# Altium schematic sheet DDR.SchDoc
size A3
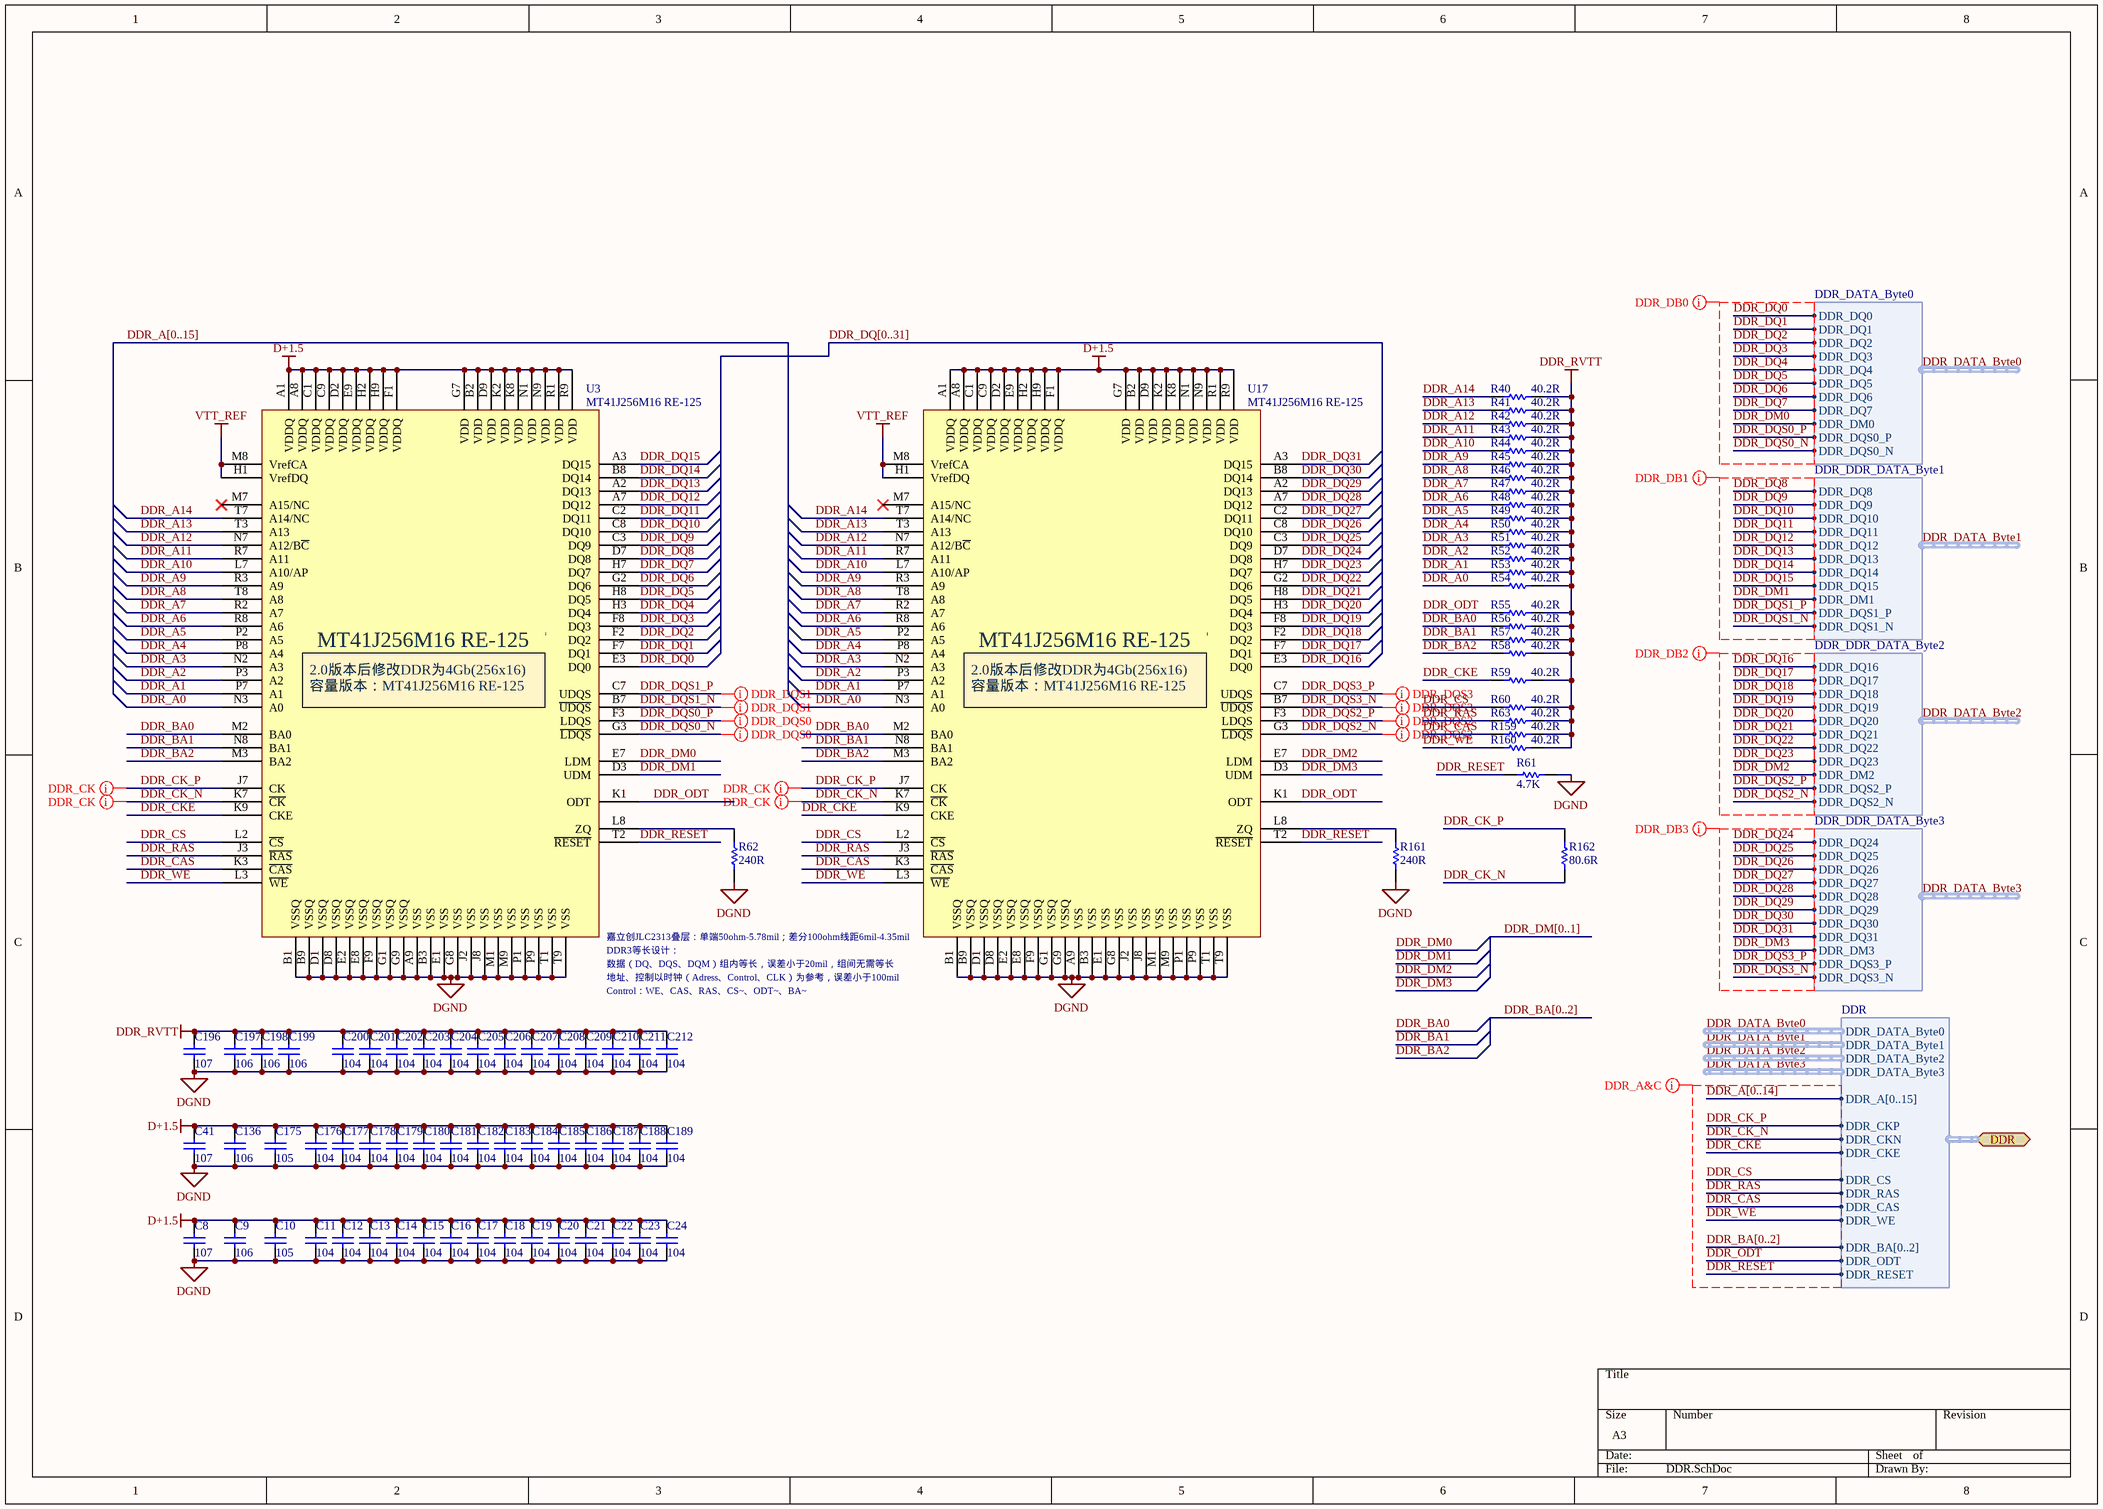
[diagram p0: DDR.SchDoc]

## Parts
C8  107  [C 1206_L]
C9  106  [C 0603_L]
C10  105  [C 0603_L]
C11  104  [C 0402_LL]
C12  104  [C 0402_LL]
C13  104  [C 0402_LL]
C14  104  [C 0402_LL]
C15  104  [C 0402_LL]
C16  104  [C 0402_LL]
C17  104  [C 0402_LL]
C18  104  [C 0402_LL]
C19  104  [C 0402_LL]
C20  104  [C 0402_LL]
C21  104  [C 0402_LL]
C22  104  [C 0402_LL]
C23  104  [C 0402_LL]
C24  104  [C 0402_LL]
C41  107  [C 1206_L]
C136  106  [C 0603_L]
C175  105  [C 0603_L]
C176  104  [C 0402_LL]
C177  104  [C 0402_LL]
C178  104  [C 0402_LL]
C179  104  [C 0402_LL]
C180  104  [C 0402_LL]
C181  104  [C 0402_LL]
C182  104  [C 0402_LL]
C183  104  [C 0402_LL]
C184  104  [C 0402_LL]
C185  104  [C 0402_LL]
C186  104  [C 0402_LL]
C187  104  [C 0402_LL]
C188  104  [C 0402_LL]
C189  104  [C 0402_LL]
C196  107  [C 1206_L]
C197  106  [C 0603_L]
C198  106  [C 0603_L]
C199  106  [C 0603_L]
C200  104  [C 0402_LL]
C201  104  [C 0402_LL]
C202  104  [C 0402_LL]
C203  104  [C 0402_LL]
C204  104  [C 0402_LL]
C205  104  [C 0402_LL]
C206  104  [C 0402_LL]
C207  104  [C 0402_LL]
C208  104  [C 0402_LL]
C209  104  [C 0402_LL]
C210  104  [C 0402_LL]
C211  104  [C 0402_LL]
C212  104  [C 0402_LL]
R40  40.2R  [R 0402_L]
R41  40.2R  [R 0402_L]
R42  40.2R  [R 0402_L]
R43  40.2R  [R 0402_L]
R44  40.2R  [R 0402_L]
R45  40.2R  [R 0402_L]
R46  40.2R  [R 0402_L]
R47  40.2R  [R 0402_L]
R48  40.2R  [R 0402_L]
R49  40.2R  [R 0402_L]
R50  40.2R  [R 0402_L]
R51  40.2R  [R 0402_L]
R52  40.2R  [R 0402_L]
R53  40.2R  [R 0402_L]
R54  40.2R  [R 0402_L]
R55  40.2R  [R 0402_L]
R56  40.2R  [R 0402_L]
R57  40.2R  [R 0402_L]
R58  40.2R  [R 0402_L]
R59  40.2R  [R 0402_L]
R60  40.2R  [R 0402_L]
R61  4.7K  [R 0402_L]
R62  240R  [R 0603_L]
R63  40.2R  [R 0402_L]
R159  40.2R  [R 0402_L]
R160  40.2R  [R 0402_L]
R161  240R  [R 0603_L]
R162  80.6R  [R 0402_L]
U3  MT41J256M16 RE-125  [FBGA96]
U17  MT41J256M16 RE-125  [FBGA96]

## Ports
DDR (bidir, harness DDR)

## Harnesses
DDR: DDR_A[0..15], DDR_CKP, DDR_CKN, DDR_CKE, DDR_CS, DDR_RAS, DDR_CAS, DDR_WE, DDR_DATA_Byte0, DDR_DATA_Byte1, DDR_DATA_Byte2, DDR_DATA_Byte3, DDR_BA[0..2], DDR_ODT, DDR_RESET
DDR_DDR_DATA_Byte3: DDR_DQ24, DDR_DQ25, DDR_DQ26, DDR_DQ27, DDR_DQ28, DDR_DQ29, DDR_DQ30, DDR_DQ31, DDR_DM3, DDR_DQS3_P, DDR_DQS3_N
DDR_DDR_DATA_Byte2: DDR_DQ16, DDR_DQ17, DDR_DQ18, DDR_DQ19, DDR_DQ20, DDR_DQ21, DDR_DQ22, DDR_DQ23, DDR_DM2, DDR_DQS2_P, DDR_DQS2_N
DDR_DDR_DATA_Byte1: DDR_DQ8, DDR_DQ9, DDR_DQ10, DDR_DQ11, DDR_DQ12, DDR_DQ13, DDR_DQ14, DDR_DQ15, DDR_DM1, DDR_DQS1_P, DDR_DQS1_N
DDR_DATA_Byte0: DDR_DQ0, DDR_DQ1, DDR_DQ2, DDR_DQ3, DDR_DQ4, DDR_DQ5, DDR_DQ6, DDR_DQ7, DDR_DM0, DDR_DQS0_P, DDR_DQS0_N

## Nets
D+1.5: C8.2 C9.2 C10.2 C11.2 C12.2 C13.2 C14.2 C15.2 C16.2 C17.2 C18.2 C19.2 C20.2 C21.2 C22.2 C23.2 C24.2 C41.2 C136.2 C175.2 C176.2 C177.2 C178.2 C179.2 C180.2 C181.2 C182.2 C183.2 C184.2 C185.2 C186.2 C187.2 C188.2 C189.2 U3.A1(VDDQ) U3.A8(VDDQ) U3.B2(VDD) U3.C1(VDDQ) U3.C9(VDDQ) U3.D2(VDDQ) U3.D9(VDD) U3.E9(VDDQ) U3.F1(VDDQ) U3.G7(VDD) U3.H2(VDDQ) U3.H9(VDDQ) U3.K2(VDD) U3.K8(VDD) U3.N1(VDD) U3.N9(VDD) U3.R1(VDD) U3.R9(VDD) U17.A1(VDDQ) U17.A8(VDDQ) U17.B2(VDD) U17.C1(VDDQ) U17.C9(VDDQ) U17.D2(VDDQ) U17.D9(VDD) U17.E9(VDDQ) U17.F1(VDDQ) U17.G7(VDD) U17.H2(VDDQ) U17.H9(VDDQ) U17.K2(VDD) U17.K8(VDD) U17.N1(VDD) U17.N9(VDD) U17.R1(VDD) U17.R9(VDD)
DDR_RVTT: C196.2 C197.2 C198.2 C199.2 C200.2 C201.2 C202.2 C203.2 C204.2 C205.2 C206.2 C207.2 C208.2 C209.2 C210.2 C211.2 C212.2 R40.2 R41.2 R42.2 R43.2 R44.2 R45.2 R46.2 R47.2 R48.2 R49.2 R50.2 R51.2 R52.2 R53.2 R54.2 R55.1 R56.2 R57.2 R58.2 R59.2 R60.2 R63.2 R159.2 R160.2
DGND: C8.1 C9.1 C10.1 C11.1 C12.1 C13.1 C14.1 C15.1 C16.1 C17.1 C18.1 C19.1 C20.1 C21.1 C22.1 C23.1 C24.1 C41.1 C136.1 C175.1 C176.1 C177.1 C178.1 C179.1 C180.1 C181.1 C182.1 C183.1 C184.1 C185.1 C186.1 C187.1 C188.1 C189.1 C196.1 C197.1 C198.1 C199.1 C200.1 C201.1 C202.1 C203.1 C204.1 C205.1 C206.1 C207.1 C208.1 C209.1 C210.1 C211.1 C212.1 R61.1 R62.1 R161.1 U3.A9(VSS) U3.B1(VSSQ) U3.B3(VSS) U3.B9(VSSQ) U3.D1(VSSQ) U3.D8(VSSQ) U3.E1(VSS) U3.E2(VSSQ) U3.E8(VSSQ) U3.F9(VSSQ) U3.G1(VSSQ) U3.G8(VSS) U3.G9(VSSQ) U3.J2(VSS) U3.J8(VSS) U3.M1(VSS) U3.M9(VSS) U3.P1(VSS) U3.P9(VSS) U3.T1(VSS) U3.T9(VSS) U17.A9(VSS) U17.B1(VSSQ) U17.B3(VSS) U17.B9(VSSQ) U17.D1(VSSQ) U17.D8(VSSQ) U17.E1(VSS) U17.E2(VSSQ) U17.E8(VSSQ) U17.F9(VSSQ) U17.G1(VSSQ) U17.G8(VSS) U17.G9(VSSQ) U17.J2(VSS) U17.J8(VSS) U17.M1(VSS) U17.M9(VSS) U17.P1(VSS) U17.P9(VSS) U17.T1(VSS) U17.T9(VSS)
VTT_REF: U3.H1(VrefDQ) U3.M8(VrefCA) U17.H1(VrefDQ) U17.M8(VrefCA)
DDR_A0: R54.1 U3.N3(A0) U17.N3(A0)
DDR_A1: R53.1 U3.P7(A1) U17.P7(A1)
DDR_A2: R52.1 U3.P3(A2) U17.P3(A2)
DDR_A3: R51.1 U3.N2(A3) U17.N2(A3)
DDR_A4: R50.1 U3.P8(A4) U17.P8(A4)
DDR_A5: R49.1 U3.P2(A5) U17.P2(A5)
DDR_A6: R48.1 U3.R8(A6) U17.R8(A6)
DDR_A7: R47.1 U3.R2(A7) U17.R2(A7)
DDR_A8: R46.1 U3.T8(A8) U17.T8(A8)
DDR_A9: R45.1 U3.R3(A9) U17.R3(A9)
DDR_A10: R44.1 U3.L7(A10/AP) U17.L7(A10/AP)
DDR_A11: R43.1 U3.R7(A11) U17.R7(A11)
DDR_A12: R42.1 U3.N7(A12/B~{C}) U17.N7(A12/B~{C})
DDR_A13: R41.1 U3.T3(A13) U17.T3(A13)
DDR_A14: R40.1 U3.T7(A14/NC) U17.T7(A14/NC)
DDR_BA0: R56.1 U3.M2(BA0) U17.M2(BA0)
DDR_BA1: R57.1 U3.N8(BA1) U17.N8(BA1)
DDR_BA2: R58.1 U3.M3(BA2) U17.M3(BA2)
DDR_CAS: R159.1 U3.K3(~{CAS}) U17.K3(~{CAS}) ; port DDR.DDR_CAS
DDR_CK_N: R162.2 U3.K7(~{CK}) U17.K7(~{CK}) ; port DDR.DDR_CKN
DDR_CK_P: R162.1 U3.J7(CK) U17.J7(CK) ; port DDR.DDR_CKP
DDR_CKE: R59.1 U3.K9(CKE) U17.K9(CKE) ; port DDR.DDR_CKE
DDR_CS: R60.1 U3.L2(~{CS}) U17.L2(~{CS}) ; port DDR.DDR_CS
DDR_DM0: U3.E7(LDM) ; harness DDR_DATA_Byte0.DDR_DM0  [project net DDR_DATA_Byte0.DDR_DM0]
DDR_DM1: U3.D3(UDM) ; harness DDR_DDR_DATA_Byte1.DDR_DM1  [project net DDR_DATA_Byte1.DDR_DM1]
DDR_DM2: U17.E7(LDM) ; harness DDR_DDR_DATA_Byte2.DDR_DM2  [project net DDR_DATA_Byte2.DDR_DM2]
DDR_DM3: U17.D3(UDM) ; harness DDR_DDR_DATA_Byte3.DDR_DM3  [project net DDR_DATA_Byte3.DDR_DM3]
DDR_DQ0: U3.E3(DQ0) ; harness DDR_DATA_Byte0.DDR_DQ0  [project net DDR_DATA_Byte0.DDR_DQ0]
DDR_DQ1: U3.F7(DQ1) ; harness DDR_DATA_Byte0.DDR_DQ1  [project net DDR_DATA_Byte0.DDR_DQ1]
DDR_DQ2: U3.F2(DQ2) ; harness DDR_DATA_Byte0.DDR_DQ2  [project net DDR_DATA_Byte0.DDR_DQ2]
DDR_DQ3: U3.F8(DQ3) ; harness DDR_DATA_Byte0.DDR_DQ3  [project net DDR_DATA_Byte0.DDR_DQ3]
DDR_DQ4: U3.H3(DQ4) ; harness DDR_DATA_Byte0.DDR_DQ4  [project net DDR_DATA_Byte0.DDR_DQ4]
DDR_DQ5: U3.H8(DQ5) ; harness DDR_DATA_Byte0.DDR_DQ5  [project net DDR_DATA_Byte0.DDR_DQ5]
DDR_DQ6: U3.G2(DQ6) ; harness DDR_DATA_Byte0.DDR_DQ6  [project net DDR_DATA_Byte0.DDR_DQ6]
DDR_DQ7: U3.H7(DQ7) ; harness DDR_DATA_Byte0.DDR_DQ7  [project net DDR_DATA_Byte0.DDR_DQ7]
DDR_DQ8: U3.D7(DQ8) ; harness DDR_DDR_DATA_Byte1.DDR_DQ8  [project net DDR_DATA_Byte1.DDR_DQ8]
DDR_DQ9: U3.C3(DQ9) ; harness DDR_DDR_DATA_Byte1.DDR_DQ9  [project net DDR_DATA_Byte1.DDR_DQ9]
DDR_DQ10: U3.C8(DQ10) ; harness DDR_DDR_DATA_Byte1.DDR_DQ10  [project net DDR_DATA_Byte1.DDR_DQ10]
DDR_DQ11: U3.C2(DQ11) ; harness DDR_DDR_DATA_Byte1.DDR_DQ11  [project net DDR_DATA_Byte1.DDR_DQ11]
DDR_DQ12: U3.A7(DQ12) ; harness DDR_DDR_DATA_Byte1.DDR_DQ12  [project net DDR_DATA_Byte1.DDR_DQ12]
DDR_DQ13: U3.A2(DQ13) ; harness DDR_DDR_DATA_Byte1.DDR_DQ13  [project net DDR_DATA_Byte1.DDR_DQ13]
DDR_DQ14: U3.B8(DQ14) ; harness DDR_DDR_DATA_Byte1.DDR_DQ14  [project net DDR_DATA_Byte1.DDR_DQ14]
DDR_DQ15: U3.A3(DQ15) ; harness DDR_DDR_DATA_Byte1.DDR_DQ15  [project net DDR_DATA_Byte1.DDR_DQ15]
DDR_DQ16: U17.E3(DQ0) ; harness DDR_DDR_DATA_Byte2.DDR_DQ16  [project net DDR_DATA_Byte2.DDR_DQ16]
DDR_DQ17: U17.F7(DQ1) ; harness DDR_DDR_DATA_Byte2.DDR_DQ17  [project net DDR_DATA_Byte2.DDR_DQ17]
DDR_DQ18: U17.F2(DQ2) ; harness DDR_DDR_DATA_Byte2.DDR_DQ18  [project net DDR_DATA_Byte2.DDR_DQ18]
DDR_DQ19: U17.F8(DQ3) ; harness DDR_DDR_DATA_Byte2.DDR_DQ19  [project net DDR_DATA_Byte2.DDR_DQ19]
DDR_DQ20: U17.H3(DQ4) ; harness DDR_DDR_DATA_Byte2.DDR_DQ20  [project net DDR_DATA_Byte2.DDR_DQ20]
DDR_DQ21: U17.H8(DQ5) ; harness DDR_DDR_DATA_Byte2.DDR_DQ21  [project net DDR_DATA_Byte2.DDR_DQ21]
DDR_DQ22: U17.G2(DQ6) ; harness DDR_DDR_DATA_Byte2.DDR_DQ22  [project net DDR_DATA_Byte2.DDR_DQ22]
DDR_DQ23: U17.H7(DQ7) ; harness DDR_DDR_DATA_Byte2.DDR_DQ23  [project net DDR_DATA_Byte2.DDR_DQ23]
DDR_DQ24: U17.D7(DQ8) ; harness DDR_DDR_DATA_Byte3.DDR_DQ24  [project net DDR_DATA_Byte3.DDR_DQ24]
DDR_DQ25: U17.C3(DQ9) ; harness DDR_DDR_DATA_Byte3.DDR_DQ25  [project net DDR_DATA_Byte3.DDR_DQ25]
DDR_DQ26: U17.C8(DQ10) ; harness DDR_DDR_DATA_Byte3.DDR_DQ26  [project net DDR_DATA_Byte3.DDR_DQ26]
DDR_DQ27: U17.C2(DQ11) ; harness DDR_DDR_DATA_Byte3.DDR_DQ27  [project net DDR_DATA_Byte3.DDR_DQ27]
DDR_DQ28: U17.A7(DQ12) ; harness DDR_DDR_DATA_Byte3.DDR_DQ28  [project net DDR_DATA_Byte3.DDR_DQ28]
DDR_DQ29: U17.A2(DQ13) ; harness DDR_DDR_DATA_Byte3.DDR_DQ29  [project net DDR_DATA_Byte3.DDR_DQ29]
DDR_DQ30: U17.B8(DQ14) ; harness DDR_DDR_DATA_Byte3.DDR_DQ30  [project net DDR_DATA_Byte3.DDR_DQ30]
DDR_DQ31: U17.A3(DQ15) ; harness DDR_DDR_DATA_Byte3.DDR_DQ31  [project net DDR_DATA_Byte3.DDR_DQ31]
DDR_DQS0_N: U3.G3(~{LDQS}) ; harness DDR_DATA_Byte0.DDR_DQS0_N  [project net DDR_DATA_Byte0.DDR_DQS0_N]
DDR_DQS0_P: U3.F3(LDQS) ; harness DDR_DATA_Byte0.DDR_DQS0_P  [project net DDR_DATA_Byte0.DDR_DQS0_P]
DDR_DQS1_N: U3.B7(~{UDQS}) ; harness DDR_DDR_DATA_Byte1.DDR_DQS1_N  [project net DDR_DATA_Byte1.DDR_DQS1_N]
DDR_DQS1_P: U3.C7(UDQS) ; harness DDR_DDR_DATA_Byte1.DDR_DQS1_P  [project net DDR_DATA_Byte1.DDR_DQS1_P]
DDR_DQS2_N: U17.G3(~{LDQS}) ; harness DDR_DDR_DATA_Byte2.DDR_DQS2_N  [project net DDR_DATA_Byte2.DDR_DQS2_N]
DDR_DQS2_P: U17.F3(LDQS) ; harness DDR_DDR_DATA_Byte2.DDR_DQS2_P  [project net DDR_DATA_Byte2.DDR_DQS2_P]
DDR_DQS3_N: U17.B7(~{UDQS}) ; harness DDR_DDR_DATA_Byte3.DDR_DQS3_N  [project net DDR_DATA_Byte3.DDR_DQS3_N]
DDR_DQS3_P: U17.C7(UDQS) ; harness DDR_DDR_DATA_Byte3.DDR_DQS3_P  [project net DDR_DATA_Byte3.DDR_DQS3_P]
DDR_ODT: R55.2 U3.K1(ODT) U17.K1(ODT) ; port DDR.DDR_ODT
DDR_RAS: R63.1 U3.J3(~{RAS}) U17.J3(~{RAS}) ; port DDR.DDR_RAS
DDR_RESET: R61.2 U3.T2(~{RESET}) U17.T2(~{RESET}) ; port DDR.DDR_RESET
DDR_WE: R160.1 U3.L3(~{WE}) U17.L3(~{WE}) ; port DDR.DDR_WE
NetR62_2: R62.2 U3.L8(ZQ)
NetR161_2: R161.2 U17.L8(ZQ)

Not connected (* = marked no-connect by the designer): U3 J1 J9 L1 L9 M7(A15/NC)*; U17 J1 J9 L1 L9 M7(A15/NC)*

## Buses and harness runs
bus DDR_A[0..14]
bus DDR_A[0..15]
bus DDR_BA[0..2]
bus DDR_DM[0..1]
bus DDR_DQ[0..31]

## Layout directives
differential pair; differential pair class DDR_DQS1: DDR_DATA_Byte1.DDR_DQS1_N, DDR_DATA_Byte1.DDR_DQS1_P
differential pair; differential pair class DDR_DQS3: DDR_DATA_Byte3.DDR_DQS3_N, DDR_DATA_Byte3.DDR_DQS3_P
differential pair; differential pair class DDR_DQS0: DDR_CK_N, DDR_CK_P, DDR_DATA_Byte0.DDR_DQS0_N, DDR_DATA_Byte0.DDR_DQS0_P
differential pair; differential pair class DDR_DQS2: DDR_DATA_Byte2.DDR_DQS2_N, DDR_DATA_Byte2.DDR_DQS2_P
net class DDR_DB0: DDR_DM0, DDR_DQ0, DDR_DQ1, DDR_DQ2, DDR_DQ3, DDR_DQ4, DDR_DQ5, DDR_DQ6, DDR_DQ7, DDR_DQS0_N, DDR_DQS0_P
net class DDR_DB1: DDR_DM1, DDR_DQ8, DDR_DQ9, DDR_DQ10, DDR_DQ11, DDR_DQ12, DDR_DQ13, DDR_DQ14, DDR_DQ15, DDR_DQS1_N, DDR_DQS1_P
net class DDR_DB2: DDR_DM2, DDR_DQ16, DDR_DQ17, DDR_DQ18, DDR_DQ19, DDR_DQ20, DDR_DQ21, DDR_DQ22, DDR_DQ23, DDR_DQS2_N, DDR_DQS2_P
net class DDR_DB3: DDR_DM3, DDR_DQ24, DDR_DQ25, DDR_DQ26, DDR_DQ27, DDR_DQ28, DDR_DQ29, DDR_DQ30, DDR_DQ31, DDR_DQS3_N, DDR_DQS3_P
net class DDR_A&C: DDR_A[0..14], DDR_BA[0..2], DDR_CAS, DDR_CK_N, DDR_CK_P, DDR_CKE, DDR_CS, DDR_ODT, DDR_RAS, DDR_RESET, DDR_WE

## Notes on the sheet
- (near U3) MT41J256M16 RE-125
- (near U17) MT41J256M16 RE-125
- (near U3) 2.0版本后修改DDR为4Gb(256x16)容量版本：MT41J256M16 RE-125
- (near U17) 2.0版本后修改DDR为4Gb(256x16)容量版本：MT41J256M16 RE-125
- (near U3) 嘉立创JLC2313叠层：单端50ohm-5.78mil；差分100ohm线距6mil-4.35mil
- (near U3) DDR3等长设计：
- (near U3) 数据（DQ、DQS、DQM）组内等长，误差小于20mil，组间无需等长
- (near U3) 地址、控制以时钟（Adress、Control、CLK）为参考，误差小于100mil
- Control：WE、CAS、RAS、CS~、ODT~、BA~

## Library data of the parts
C8-C24 C41 C136 C175-C189 C196-C212 = Cap: Capacitor; Published: 8-Jun-2000; LatestRevisionDate: 17-Jul-2002; LatestRevisionNote: Re-released for DXP Platform.; PackageReference: RAD-0.3; Publisher: Altium Limited; PackageDescription: Radial Cap, Thru-Hole; 2 Leads; 0.3 in Pin Spacing
R40-R63 R159-R162 = Res1: Resistor; Value: 1K; Published: 8-Jun-2000; LatestRevisionDate: 17-Jul-2002; LatestRevisionNote: Re-released for DXP Platform.; PackageReference: AXIAL-0.3; Publisher: Altium Limited; PackageDescription: Axial Device, Thru-Hole; 2 Leads; 0.3 in Pin Spacing
U3 U17 = MT41J128M16HA-125 IT: DDR3，存储芯片; Manufacturer: Micron; value: NC